# Altium schematic sheet Sheet1.SchDoc
size A4; SheetNumber: 2; SheetTotal: 5
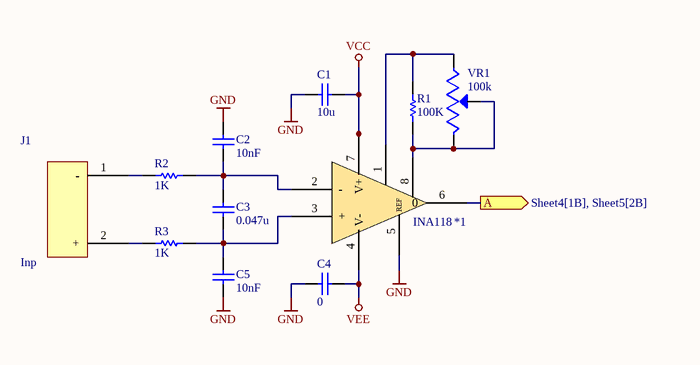
[diagram p0: Sheet1.SchDoc]

## Parts
*1  INA118  [SOIC127P599X175-8N]
C1  value 10u  [CAPC2012X150N]  (hidden comment: Capacitor)
C2  value 10nF  [CAPC2012X150N]  (hidden comment: Capacitor)
C3  value 0.047u  [CAPC2012X150N]  (hidden comment: Capacitor)
C4  value 0  [CAPC2012X150N]  (hidden comment: Capacitor)
C5  value 10nF  [CAPC2012X150N]  (hidden comment: Capacitor)
J1  Inp  [JST_B2B-XH-A_(LF)(SN)]
R1  value 100K  [RES_ERA6AHD330V]  (hidden comment: Resistor)
R2  value 1K  [RES_ERA6AHD330V]  (hidden comment: Resistor)
R3  value 1K  [RES_ERA6AHD330V]  (hidden comment: Resistor)
VR1  100k  [TRIM_3296W-1-103RLF]

## Ports
A (out, see Sheet4[1B], Sheet5[2B])

## Nets
GND: *1.5(REF) C1.2 C2.2 C4.2 C5.1
VCC: *1.7(V+) C1.1
VEE: *1.4(V-) C4.1
A: *1.6(0) ; port A
Net*1_1: *1.1 R1.2 VR1.1(CCW)
Net*1_2: *1.2(-) C2.1 C3.2 R2.2
Net*1_3: *1.3(+) C3.1 C5.2 R3.2
Net*1_8: *1.8 R1.1 VR1.2(WIPER) VR1.3(CW)
NetJ1_1: J1.1(-) R2.1
NetJ1_2: J1.2(+) R3.1

## Library data of the parts
C1-C5 = Capacitor: SimulationGenericComponent: True
R1-R3 = Resistor: TC1: 0; SimulationGenericComponent: True; TC2: 0
VR1 = 3296W-1-103RLF: Trimmer, Cermet, Rest 10 Kilohms, PCB, 25 Turns, Pwr-Rtg 0.5W | Bourns 3296W-1-103RLF; SnapEDA_Link: https://www.snapeda.com/parts/3296W-1-103RLF/Bourns/view-part/?ref=snap; Package: NON STANDARD-3 Bourns; Value: *; MF: Bourns; MP: 3296W-1-103RLF; Check_prices: https://www.snapeda.com/parts/3296W-1-103RLF/Bourns/view-part/?ref=eda